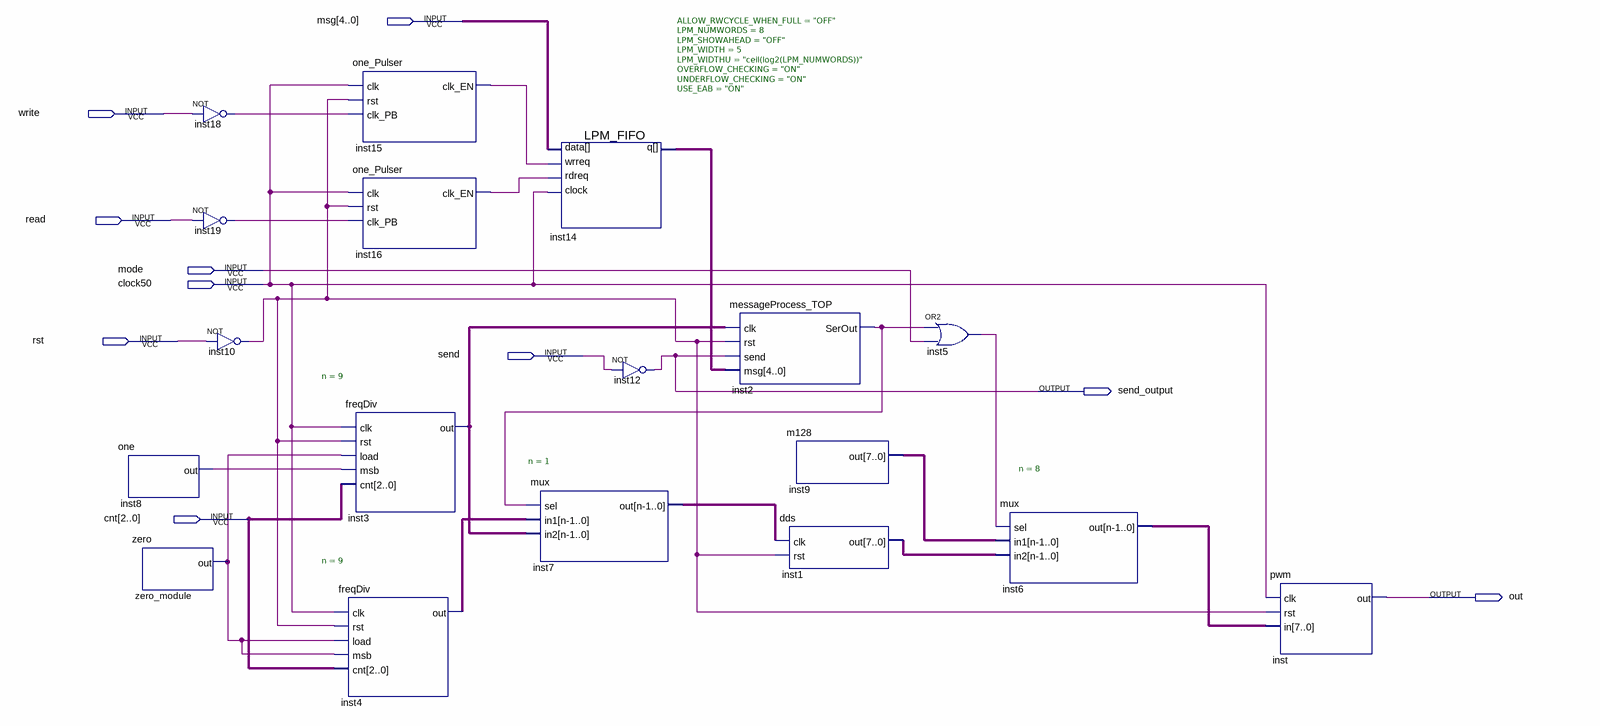
[diagram p0: schematic sheet]
// Quartus schematic lab3.bdf as structural Verilog: 18 symbols, 10 pins
module lab3 (
  input  [4:0] msg,
  input  write,
  input  read,
  input  mode,
  input  clock50,
  input  rst,
  input  send,
  input  [2:0] cnt,
  output send_output,
  output out
);

  wire inst2_serout, inst3_out, inst4_out, inst5_out, inst7_out, inst8_out, inst10_out, inst15_clk_en,
       inst16_clk_en, inst18_out, inst19_out, zero_module_out;
  wire [4:0] inst14_q;
  wire [7:0] inst1_out, inst6_out, inst9_out;

  one inst8 (.out(inst8_out));
  zero zero_module (.out(zero_module_out));
  not inst18 (inst18_out, write);
  not inst19 (inst19_out, read);
  not inst10 (inst10_out, rst);
  one_Pulser inst15 (.clk(clock50), .rst(inst10_out), .clk_PB(inst18_out), .clk_EN(inst15_clk_en));
  one_Pulser inst16 (.clk(clock50), .rst(inst10_out), .clk_PB(inst19_out), .clk_EN(inst16_clk_en));
  freqDiv #(.n(9)) inst3 (
    .clk(clock50), .rst(inst10_out), .load(zero_module_out), .msb(inst8_out), .cnt(cnt), .out(inst3_out));
  freqDiv #(.n(9)) inst4 (
    .clk(clock50), .rst(inst10_out), .load(zero_module_out), .msb(zero_module_out), .cnt(cnt), .out(inst4_out));
  mux #(.n(1)) inst7 (.sel(inst2_serout), .in1(inst4_out), .in2(inst3_out), .out(inst7_out));
  LPM_FIFO #(.ALLOW_RWCYCLE_WHEN_FULL("OFF"), .LPM_NUMWORDS(8), .LPM_SHOWAHEAD("OFF"), .LPM_WIDTH(5), .LPM_WIDTHU("ceil(log2(LPM_NUMWORDS))"), .OVERFLOW_CHECKING("ON"), .UNDERFLOW_CHECKING("ON"), .USE_EAB("ON")) inst14 (
    .clock(clock50), .data(msg), .rdreq(inst16_clk_en), .wrreq(inst15_clk_en), .q(inst14_q));
  not inst12 (send_output, send);
  messageProcess_TOP inst2 (
    .clk(inst3_out), .rst(inst10_out), .send(send_output), .msg(inst14_q), .SerOut(inst2_serout));
  m128 inst9 (.out(inst9_out));
  dds inst1 (.clk(inst7_out), .rst(inst10_out), .out(inst1_out));
  or inst5 (inst5_out, inst2_serout, mode);
  mux #(.n(8)) inst6 (.sel(inst5_out), .in1(inst9_out), .in2(inst1_out), .out(inst6_out));
  pwm inst (.clk(clock50), .rst(inst10_out), .in(inst6_out), .out(out));
endmodule
